# EAGLE schematic LT3042 (EAGLE 7.2.0)
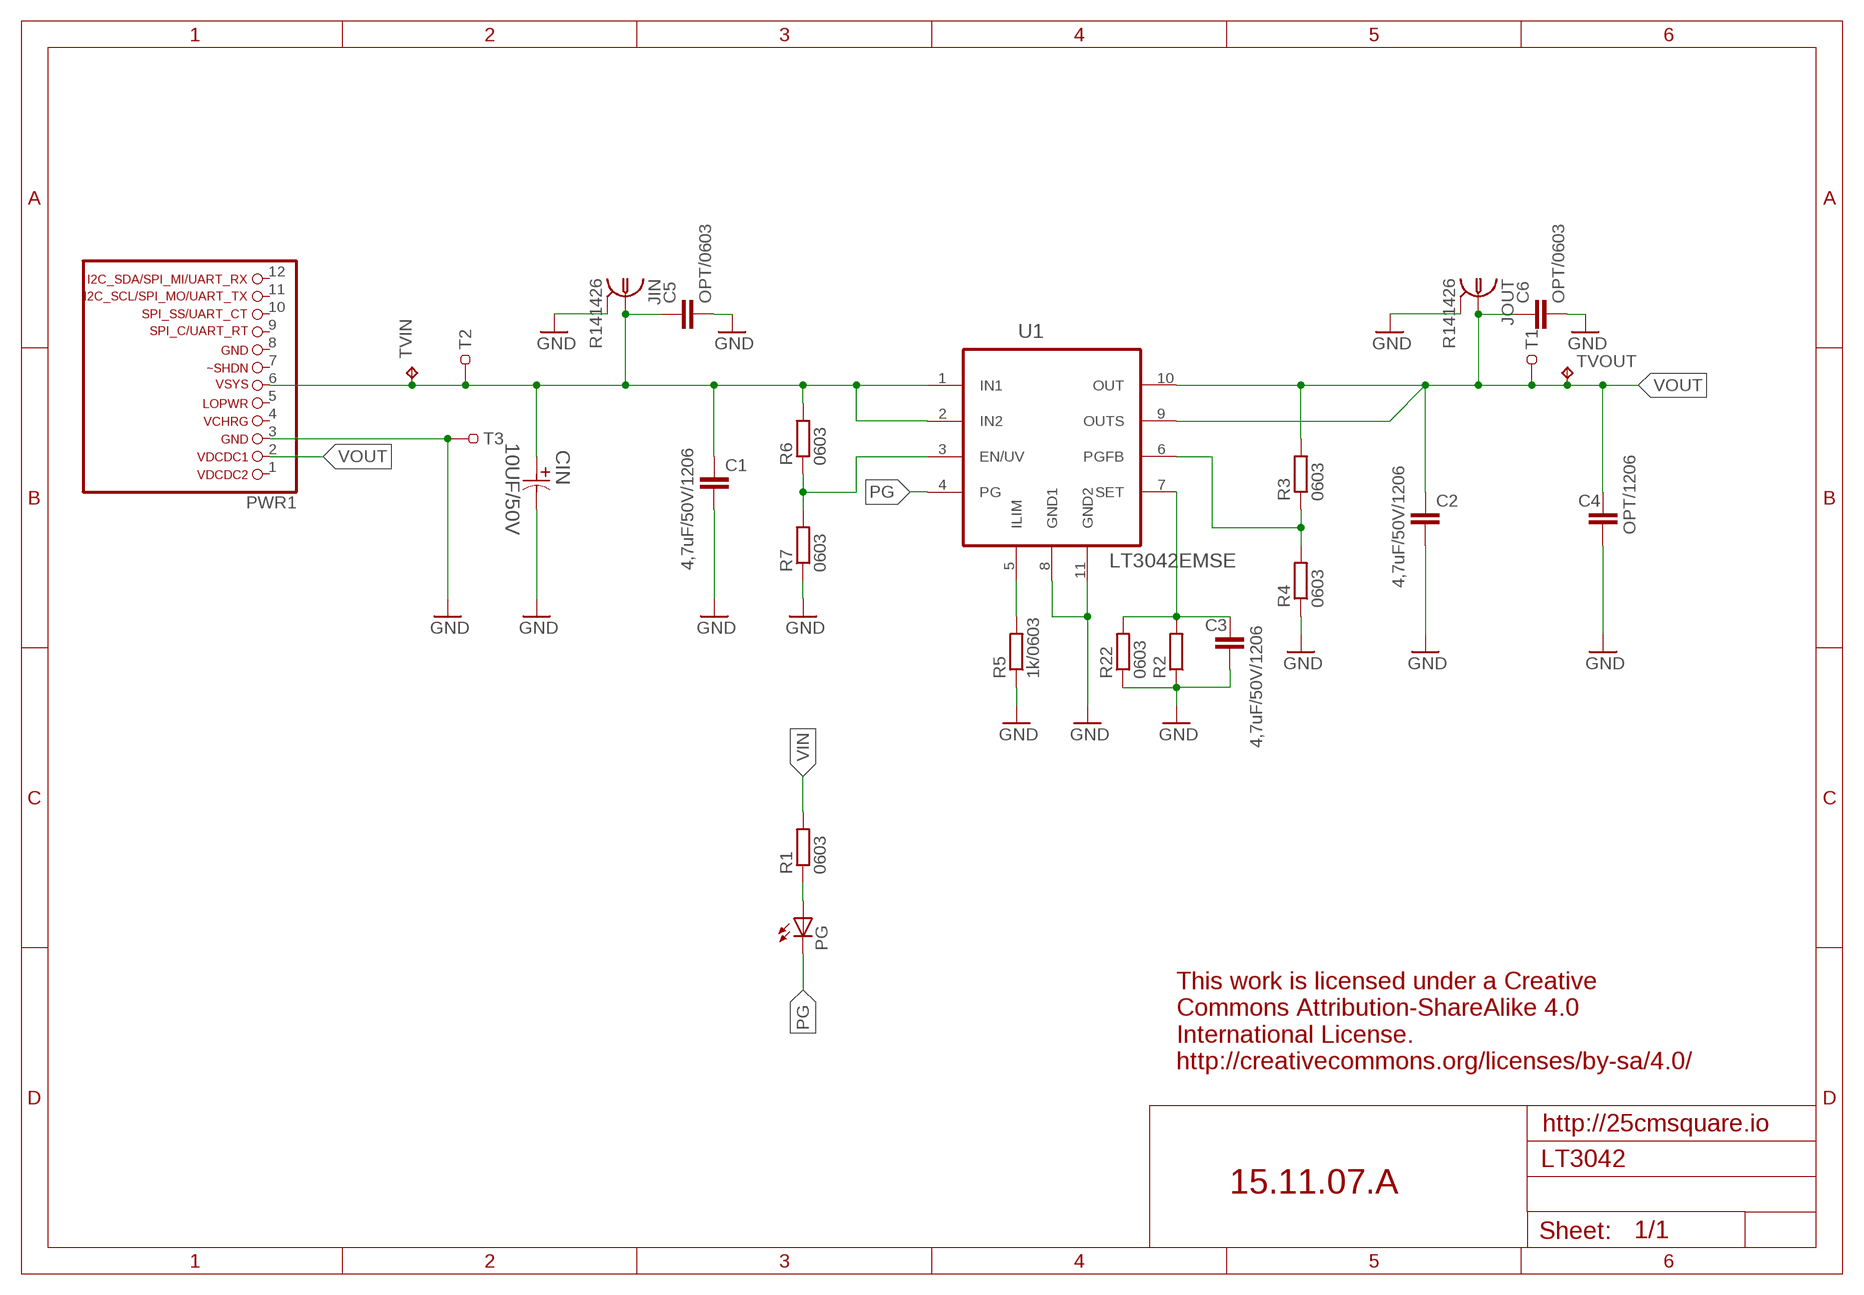
[diagram p0: schematic, sheet 1]

## Parts
C1  4,7uF/50V/1206  C-EUC1206K  [C1206K]
C2  4,7uF/50V/1206  C-EUC1206K  [C1206K]
C3  4,7uF/50V/1206  C-EUC1206K  [C1206K]
C4  OPT/1206  C-EUC1206K  [C1206K]
C5  OPT/0603  C-EUC0603K  [C0603K]
C6  OPT/0603  C-EUC0603K  [C0603K]
CIN  10UF/50V  EEE-FK1H100UR-CASE-C  [CAPAE530X610N]
JIN  R141426  [R141426]
JOUT  R141426  [R141426]
PG  LEDSML0603  [SML0603]
PWR1  LIWE_12_PIN_PWR  [LIWE_12_PIN]
R1  0603  R-EU_R0603  [R0603]
R2  R-EU_0309_10  [0309/10]
R3  0603  R-EU_R0603  [R0603]
R4  0603  R-EU_R0603  [R0603]
R5  1k/0603  R-EU_R0603  [R0603]
R6  0603  R-EU_R0603  [R0603]
R7  0603  R-EU_R0603  [R0603]
R22  0603  R-EU_R0603  [R0603]
T1  TEST-22-MULTICOMP  [TEST_1MM]
T2  TEST-22-MULTICOMP  [TEST_1MM]
T3  TEST-22-MULTICOMP  [TEST_1MM]
TVIN  TPTP14R  [TP14R]
TVOUT  TPTP14R  [TP14R]
U1  LT3042EMSE  [MSOP10-EPAD]

## Nets
GND: C1.2 C2.2 C3.2 C4.2 C5.2 C6.2 CIN.2 JIN.2 JIN.3 JIN.4 JIN.5 JOUT.2 JOUT.3 JOUT.4 JOUT.5 PWR1.3 R2.1 R4.1 R5.1 R7.1 R22.1 T3.1 U1.8(GND1) U1.11(GND2)
N$4: PG.A R1.1
PG: PG.C U1.4(PG)
VENUV: R6.1 R7.2 U1.3(EN/UV)
VILIM: R5.2 U1.5(ILIM)
VIN: C1.1 C5.1 CIN.1 JIN.1 PWR1.6 R1.2 R6.2 T2.1 TVIN.TP U1.1(IN1) U1.2(IN2)
VOUT: C2.1 C4.1 C6.1 JOUT.1 PWR1.2 R3.2 T1.1 TVOUT.TP U1.9(OUTS) U1.10(OUT)
VPGFB: R3.1 R4.2 U1.6(PGFB)
VSET: C3.1 R2.2 R22.2 U1.7(SET)
Unconnected: PWR1.1 PWR1.4 PWR1.5 PWR1.7 PWR1.8 PWR1.9 PWR1.10 PWR1.11 PWR1.12

## Notes on the sheet
- This work is licensed under a Creative
  Commons Attribution-ShareAlike 4.0
  International License.
  http://creativecommons.org/licenses/by-sa/4.0/
- http://25cmsquare.io
- 15.11.07.A

## Library data of the parts
C1-C6 = resistor:C-EU: CAPACITOR, European symbol; SPICEPREFIX: C
CIN = Panasonic-EEEFK_EEEFP:EEE-: Aluminum Electrolytic Capacitors,Surface Mount Type; MPN: EEE-FK1H100UR; OC_FARNELL: 9695907; OC_NEWARK: 96K9392; PACKAGE: CASE-C; SUPPLIER: PANASONIC; TOLERANCE: ±20 %; VALUE: 10UF; VOLTAGERATING: 50V
JIN JOUT = con-coax:R141426: BNC COAX CONNECTOR Radiall 50/75 Ohm Spoerle; MF: FARNELL; MPN: R141426161; OC_FARNELL: 4195115; OC_NEWARK: 14J7919
PG = led:LED: LED OSRAM: - CHIPLED LG R971, LG N971, LY N971, LG Q971, LY Q971, LO R971, LY R971 LH N974, LH R974 LS Q976, LO Q976, LY Q976 LO Q996 - Hyper CHIPLED LW Q18S LB Q993, LB Q99A, LB R99A - SideLED LS A670, LO A670, LY A670, LG A670, LP A670 LB A673, LV A673, LT A673, LW A673 LH A674 LY A675 LS A676, LA A676, LO A676, LY A676, LW A676 LS A679, LY A679, LG A679 - Hyper Micro SIDELED® LS Y876, LA Y876, LO Y876, LY Y876 LT Y87S - SmartLED LW L88C, LW L88S LB L89C, LB L89S, LG L890 LS L89K, LO L89K, LY L89K LS L896, LA L896, LO L896, LY L896 - TOPLED LS T670, LO T670, LY T670, LG T670, LP T670 LSG T670, LSP T670, LSY T670, LOP T670, LYG T670 LG T671, LOG T671, LSG T671 LB T673, LV T673, LT T673, LW T673 LH T674 LS T676, LA T676, LO T676, LY T676, LB T676, LH T676, LSB T676, LW T676 LB T67C, LV T67C, LT T67C, LS T67K, LO T67K, LY T67K, LW E67C LS E67B, LA E67B, LO E67B, LY E67B, LB E67C, LV E67C, LT E67C LW T67C LS T679, LY T679, LG T679 LS T770, LO T770, LY T770, LG T770, LP T770 LB T773, LV T773, LT T773, LW T773 LH T774 LS E675, LA E675, LY E675, LS T675 LS T776, LA T776, LO T776, LY T776, LB T776 LHGB T686 LT T68C, LB T68C - Hyper Mini TOPLED® LB M676 - Mini TOPLED Santana® LG M470 LS M47K, LO M47K, LY M47K Source: http://www.osram.convergy.de LUXEON: - LUMILED® LXK2-PW12-R00, LXK2-PW12-S00, LXK2-PW14-U00, LXK2-PW14-V00 LXK2-PM12-R00, LXK2-PM12-S00, LXK2-PM14-U00 LXK2-PE12-Q00, LXK2-PE12-R00, LXK2-PE12-S00, LXK2-PE14-T00, LXK2-PE14-U00 LXK2-PB12-K00, LXK2-PB12-L00, LXK2-PB12-M00, LXK2-PB14-N00, LXK2-PB14-P00, LXK2-PB14-Q00 LXK2-PR12-L00, LXK2-PR12-M00, LXK2-PR14-Q00, LXK2-PR14-R00 LXK2-PD12-Q00, LXK2-PD12-R00, LXK2-PD12-S00 LXK2-PH12-R00, LXK2-PH12-S00 LXK2-PL12-P00, LXK2-PL12-Q00, LXK2-PL12-R00 Source: www.luxeon.com KINGBRIGHT: KA-3528ASYC Source: www.kingbright.com
PWR1 = pma:LIWE_12_PIN_PWR
R1-R7 R22 = resistor:R-EU_: RESISTOR, European symbol; SPICEPREFIX: R
T1-T3 = pma:TEST-22-MULTICOMP: MULTICOMP TEST-22 TEST PIN, PCB, 1.0MM FARNELL: 1702010
TVIN TVOUT = testpad:TP: Test pad
U1 = pma:LT3042: LT3042 20V, 200mA, Ultralow Noise, Ultrahigh PSRR RF Linear Regulator